# EAGLE schematic PCB-TLY-JACK-MEGA (EAGLE 6.5.0)

## Sheet 1 of 2
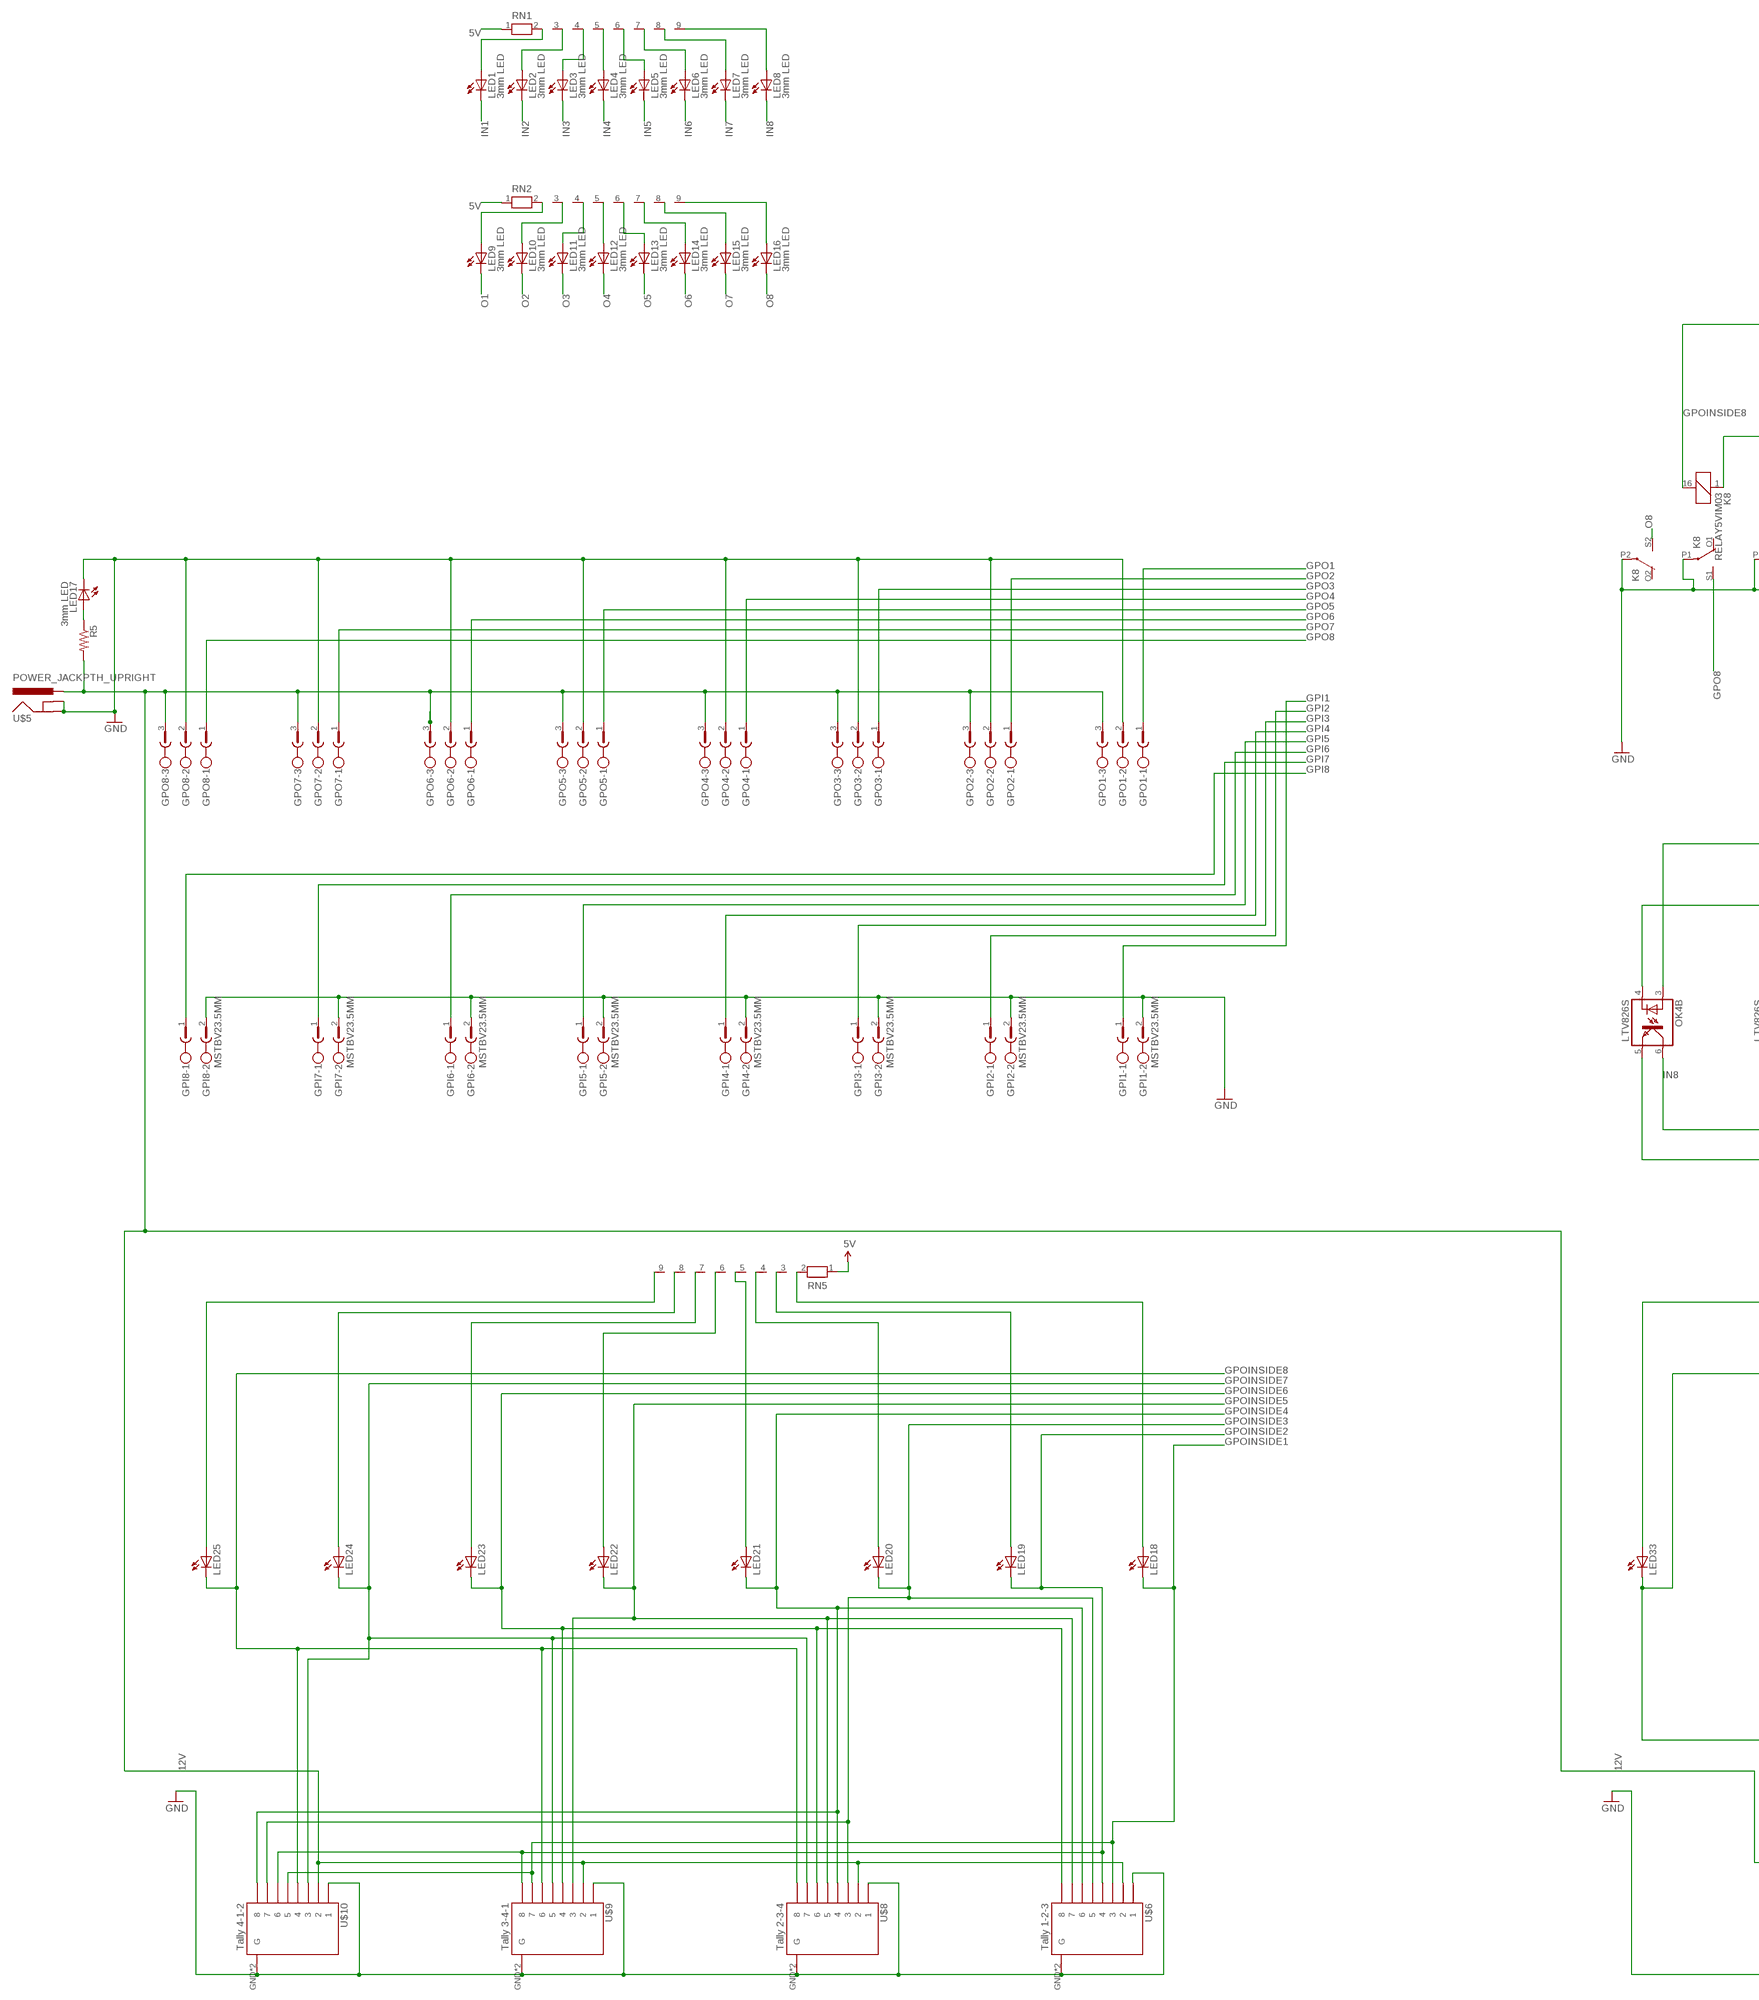
[diagram p0: schematic, sheet 1, part 1 of 2]
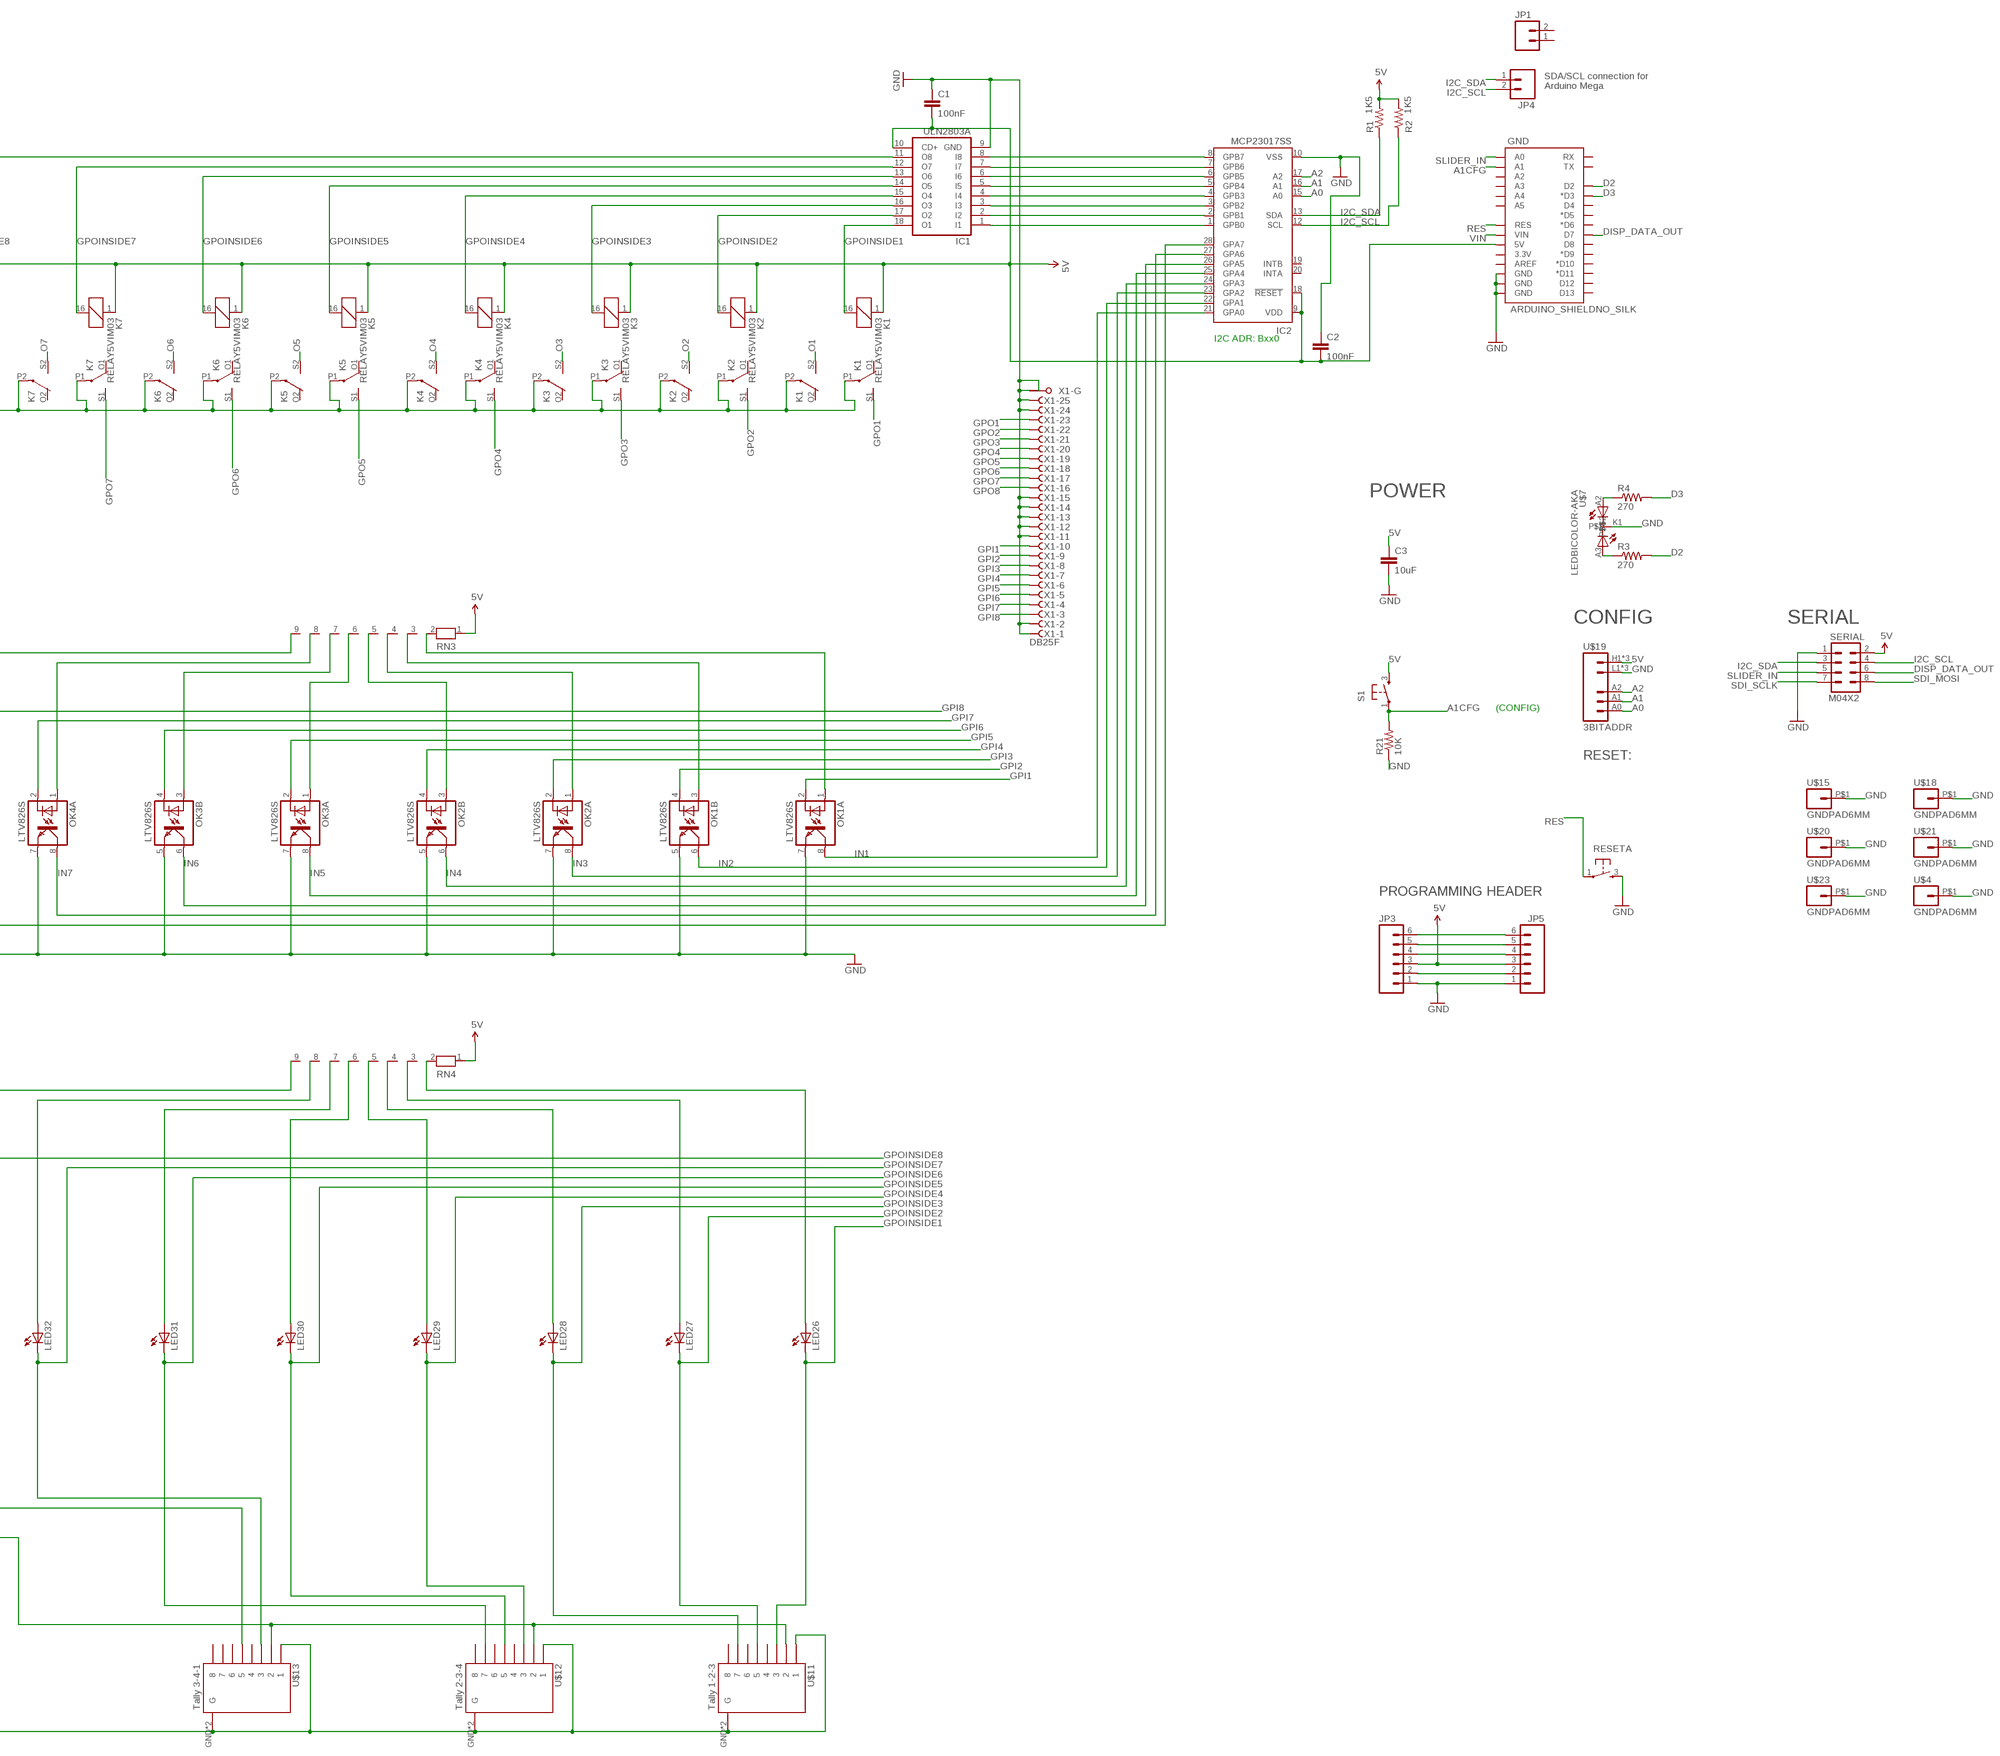
[diagram p1: schematic, sheet 1, part 2 of 2]

### Parts
C1  100nF  CAP0805  [0805]
C2  100nF  CAP0603-CAP  [0603-CAP]
C3  10uF  CAP0805  [0805]
GND  ARDUINO_SHIELDNO_SILK  [DUEMILANOVE_VIAS]
GPI1  MSTBV23.5MM  [MSTBV2-3.5]
GPI2  MSTBV23.5MM  [MSTBV2-3.5]
GPI3  MSTBV23.5MM  [MSTBV2-3.5]
GPI4  MSTBV23.5MM  [MSTBV2-3.5]
GPI5  MSTBV23.5MM  [MSTBV2-3.5]
GPI6  MSTBV23.5MM  [MSTBV2-3.5]
GPI7  MSTBV23.5MM  [MSTBV2-3.5]
GPI8  MSTBV23.5MM  [MSTBV2-3.5]
GPO1  CON1  MSTBV33.5MM  [MSTBV3-3.5]
GPO2  CON1  MSTBV33.5MM  [MSTBV3-3.5]
GPO3  CON1  MSTBV33.5MM  [MSTBV3-3.5]
GPO4  CON1  MSTBV33.5MM  [MSTBV3-3.5]
GPO5  CON1  MSTBV33.5MM  [MSTBV3-3.5]
GPO6  CON1  MSTBV33.5MM  [MSTBV3-3.5]
GPO7  CON1  MSTBV33.5MM  [MSTBV3-3.5]
GPO8  CON1  MSTBV33.5MM  [MSTBV3-3.5]
IC1  ULN2803A  ULN2803ASO18W  [SO18W]
IC2  MCP23017SS  [SSOP28]
JP1  M02PTH  [1X02]
JP3  M06POLAR  [MOLEX-1X6]
JP4  M02PTH  [1X02]
JP5  M06POLAR  [MOLEX-1X6]
K1  RELAY5VIM03  [DS2Y]
K2  RELAY5VIM03  [DS2Y]
K3  RELAY5VIM03  [DS2Y]
K4  RELAY5VIM03  [DS2Y]
K5  RELAY5VIM03  [DS2Y]
K6  RELAY5VIM03  [DS2Y]
K7  RELAY5VIM03  [DS2Y]
K8  RELAY5VIM03  [DS2Y]
LED1  3mm LED  LED3MM  [LED3MM]
LED2  3mm LED  LED3MM  [LED3MM]
LED3  3mm LED  LED3MM  [LED3MM]
LED4  3mm LED  LED3MM  [LED3MM]
LED5  3mm LED  LED3MM  [LED3MM]
LED6  3mm LED  LED3MM  [LED3MM]
LED7  3mm LED  LED3MM  [LED3MM]
LED8  3mm LED  LED3MM  [LED3MM]
LED9  3mm LED  LED3MM  [LED3MM]
LED10  3mm LED  LED3MM  [LED3MM]
LED11  3mm LED  LED3MM  [LED3MM]
LED12  3mm LED  LED3MM  [LED3MM]
LED13  3mm LED  LED3MM  [LED3MM]
LED14  3mm LED  LED3MM  [LED3MM]
LED15  3mm LED  LED3MM  [LED3MM]
LED16  3mm LED  LED3MM  [LED3MM]
LED17  3mm LED  LED3MM  [LED3MM]
LED18  LED3MM  [LED3MM]
LED19  LED3MM  [LED3MM]
LED20  LED3MM  [LED3MM]
LED21  LED3MM  [LED3MM]
LED22  LED3MM  [LED3MM]
LED23  LED3MM  [LED3MM]
LED24  LED3MM  [LED3MM]
LED25  LED3MM  [LED3MM]
LED26  LED3MM  [LED3MM]
LED27  LED3MM  [LED3MM]
LED28  LED3MM  [LED3MM]
LED29  LED3MM  [LED3MM]
LED30  LED3MM  [LED3MM]
LED31  LED3MM  [LED3MM]
LED32  LED3MM  [LED3MM]
LED33  LED3MM  [LED3MM]
OK1  LTV826S  [DIL8-SMD]
OK2  LTV826S  [DIL8-SMD]
OK3  LTV826S  [DIL8-SMD]
OK4  LTV826S  [DIL8-SMD]
R1  1K5  RESISTOR0603-RES  [0603-RES]
R2  1K5  RESISTOR0603-RES  [0603-RES]
R3  270  RESISTOR0603-RES  [0603-RES]
R4  270  RESISTOR0603-RES  [0603-RES]
R5  RESISTOR0603-RES  [0603-RES]
R21  10K  RESISTOR0603-RES  [0603-RES]
RESETA  TAC_SWITCH  [PUSHBUTTON]
RN1  RN08  [RN-9]
RN2  RN08  [RN-9]
RN3  RN08  [RN-9]
RN4  RN08  [RN-9]
RN5  RN08  [RN-9]
S1  TAC_SWITCH  [PUSHBUTTON]
SERIAL  M04X2  [2X4]
U$4  GNDPAD6MM  [3.2MMPAD6MM]
U$5  POWER_JACKPTH_UPRIGHT  [POWER_JACK_PTH_UPRIGHT]
U$6  Tally 1-2-3  RJ45-8_GNDUPRIGHT  [RJ45-8_GND_UPRIGHT]
U$7  LEDBICOLOR-AKA  [LED5MM-BICOLOR]
U$8  Tally 2-3-4  RJ45-8_GNDUPRIGHT  [RJ45-8_GND_UPRIGHT]
U$9  Tally 3-4-1  RJ45-8_GNDUPRIGHT  [RJ45-8_GND_UPRIGHT]
U$10  Tally 4-1-2  RJ45-8_GNDUPRIGHT  [RJ45-8_GND_UPRIGHT]
U$11  Tally 1-2-3  RJ45-8_GNDUPRIGHT  [RJ45-8_GND_UPRIGHT]
U$12  Tally 2-3-4  RJ45-8_GNDUPRIGHT  [RJ45-8_GND_UPRIGHT]
U$13  Tally 3-4-1  RJ45-8_GNDUPRIGHT  [RJ45-8_GND_UPRIGHT]
U$15  GNDPAD6MM  [3.2MMPAD6MM]
U$18  GNDPAD6MM  [3.2MMPAD6MM]
U$19  3BITADDR  [3BITADDR]
U$20  GNDPAD6MM  [3.2MMPAD6MM]
U$21  GNDPAD6MM  [3.2MMPAD6MM]
U$23  GNDPAD6MM  [3.2MMPAD6MM]
X1  DB25F  F25HPS  [F25HP]

### Nets
5V [PWR]: C1.2 C2.2 C3.1 GND.5V IC1.10(CD+) IC2.9(VDD) IC2.18(!RESET) JP3.3 JP5.3 K1.1 K2.1 K3.1 K4.1 K5.1 K6.1 K7.1 K8.1 R1.2 R2.2 RN1.1 RN2.1 RN3.1 RN4.1 RN5.1 S1.3 SERIAL.2 U$19.H1(VCC) U$19.H2(VCC) U$19.H3(VCC)
12V [PWR]: GPO1.3 GPO2.3 GPO3.3 GPO4.3 GPO5.3 GPO6.3 GPO7.3 GPO8.3 R5.2 U$5.PWR U$6.2 U$8.2 U$9.2 U$10.2 U$11.2 U$12.2 U$13.2
A0: IC2.15(A0) U$19.A0
A1: IC2.16(A1) U$19.A1
A1CFG: GND.A1 R21.2 S1.1
A2: IC2.17(A2) U$19.A2
D2: GND.D2 R3.2
D3: GND.D3(*D3) R4.2
DISP_DATA_OUT: GND.D7 SERIAL.6
GND [PWR]: C1.1 C2.1 C3.2 GND.GND@0(GND) GND.GND@1(GND) GND.GND@2(GND) GPI1.2 GPI2.2 GPI3.2 GPI4.2 GPI5.2 GPI6.2 GPI7.2 GPI8.2 GPO1.2 GPO2.2 GPO3.2 GPO4.2 GPO5.2 GPO6.2 GPO7.2 GPO8.2 IC1.9(GND) IC2.10(VSS) JP3.1 JP5.1 K1.P1(2:P) K1.P2(3:P) K2.P1(2:P) K2.P2(3:P) K3.P1(2:P) K3.P2(3:P) K4.P1(2:P) K4.P2(3:P) K5.P1(2:P) K5.P2(3:P) K6.P1(2:P) K6.P2(3:P) K7.P1(2:P) K7.P2(3:P) K8.P1(2:P) K8.P2(3:P) LED17.K(C) OK1.5(B:EMIT) OK1.7(A:EMIT) OK2.5(B:EMIT) OK2.7(A:EMIT) OK3.5(B:EMIT) OK3.7(A:EMIT) OK4.5(B:EMIT) OK4.7(A:EMIT) R21.1 RESETA.3 SERIAL.1 U$4.P$1 U$5.GND U$5.SHUNT(GNDBREAK) U$6.1 U$6.GND1(G) U$6.GND(G) U$7.K1 U$8.1 U$8.GND1(G) U$8.GND(G) U$9.1 U$9.GND1(G) U$9.GND(G) U$10.1 U$10.GND1(G) U$10.GND(G) U$11.1 U$11.GND1(G) U$11.GND(G) U$12.1 U$12.GND1(G) U$12.GND(G) U$13.1 U$13.GND1(G) U$13.GND(G) U$15.P$1 U$18.P$1 U$19.L1(GND) U$19.L2(GND) U$19.L3(GND) U$20.P$1 U$21.P$1 U$23.P$1 X1.1(-1:F) X1.2(-2:F) X1.11(-11:F) X1.12(-12:F) X1.13(-13:F) X1.14(-14:F) X1.15(-15:F) X1.24(-24:F) X1.25(-25:F) X1.G1(-G:G1) X1.G2(-G:G2)
GPI1 [INput lines]: GPI1.1 OK1.2(A:C) X1.10(-10:F)
GPI2 [INput lines]: GPI2.1 OK1.4(B:C) X1.9(-9:F)
GPI3 [INput lines]: GPI3.1 OK2.2(A:C) X1.8(-8:F)
GPI4 [INput lines]: GPI4.1 OK2.4(B:C) X1.7(-7:F)
GPI5 [INput lines]: GPI5.1 OK3.2(A:C) X1.6(-6:F)
GPI6 [INput lines]: GPI6.1 OK3.4(B:C) X1.5(-5:F)
GPI7 [INput lines]: GPI7.1 OK4.2(A:C) X1.4(-4:F)
GPI8 [INput lines]: GPI8.1 OK4.4(B:C) X1.3(-3:F)
GPO1 [RELAY LINES]: GPO1.1 K1.S1(2:S) X1.23(-23:F)
GPO2 [RELAY LINES]: GPO2.1 K2.S1(2:S) X1.22(-22:F)
GPO3 [RELAY LINES]: GPO3.1 K3.S1(2:S) X1.21(-21:F)
GPO4 [RELAY LINES]: GPO4.1 K4.S1(2:S) X1.20(-20:F)
GPO5 [RELAY LINES]: GPO5.1 K5.S1(2:S) X1.19(-19:F)
GPO6 [RELAY LINES]: GPO6.1 K6.S1(2:S) X1.18(-18:F)
GPO7 [RELAY LINES]: GPO7.1 K7.S1(2:S) X1.17(-17:F)
GPO8 [RELAY LINES]: GPO8.1 K8.S1(2:S) X1.16(-16:F)
GPOINSIDE1: IC1.18(O1) K1.16 LED18.K(C) LED26.K(C) U$6.3 U$9.7 U$10.5 U$11.3
GPOINSIDE2: IC1.17(O2) K2.16 LED19.K(C) LED27.K(C) U$6.4 U$9.8 U$10.6 U$11.5
GPOINSIDE3: IC1.16(O3) K3.16 LED20.K(C) LED28.K(C) U$6.5 U$8.3 U$10.7 U$11.7
GPOINSIDE4: IC1.15(O4) K4.16 LED21.K(C) LED29.K(C) U$6.6 U$8.4 U$10.8 U$12.3
GPOINSIDE5: IC1.14(O5) K5.16 LED22.K(C) LED30.K(C) U$6.7 U$8.5 U$9.3 U$12.5
GPOINSIDE6: IC1.13(O6) K6.16 LED23.K(C) LED31.K(C) U$6.8 U$8.6 U$9.4 U$12.7
GPOINSIDE7: IC1.12(O7) K7.16 LED24.K(C) LED32.K(C) U$8.7 U$9.5 U$10.3 U$13.3
GPOINSIDE8: IC1.11(O8) K8.16 LED25.K(C) LED33.K(C) U$8.8 U$9.6 U$10.4 U$13.5
I2C_SCL: IC2.12(SCL) JP4.2 R2.1 SERIAL.4
I2C_SDA: IC2.13(SDA) JP4.1 R1.1 SERIAL.3
IN1: IC2.21(GPA0) LED1.K(C) OK1.8(A:COL)
IN2: IC2.22(GPA1) LED2.K(C) OK1.6(B:COL)
IN3: IC2.23(GPA2) LED3.K(C) OK2.8(A:COL)
IN4: IC2.24(GPA3) LED4.K(C) OK2.6(B:COL)
IN5: IC2.25(GPA4) LED5.K(C) OK3.8(A:COL)
IN6: IC2.26(GPA5) LED6.K(C) OK3.6(B:COL)
IN7: IC2.27(GPA6) LED7.K(C) OK4.8(A:COL)
IN8: IC2.28(GPA7) LED8.K(C) OK4.6(B:COL)
N$1: LED1.A RN1.2
N$2: LED2.A RN1.3
N$3: JP3.4 JP5.4
N$4: LED18.A RN5.2
N$5: IC1.1(I1) IC2.1(GPB0)
N$6: LED3.A RN1.4
N$7: R4.1 U$7.A2
N$8: JP3.5 JP5.5
N$9: LED19.A RN5.3
N$10: LED4.A RN1.5
N$11: R3.1 U$7.A3
N$12: JP3.2 JP5.2
N$13: LED20.A RN5.4
N$14: LED5.A RN1.6
N$15: LED6.A RN1.7
N$16: LED7.A RN1.8
N$17: LED21.A RN5.5
N$18: LED8.A RN1.9
N$19: LED9.A RN2.2
N$20: LED10.A RN2.3
N$21: LED22.A RN5.6
N$22: LED11.A RN2.4
N$23: LED12.A RN2.5
N$24: LED13.A RN2.6
N$25: LED23.A RN5.7
N$26: LED14.A RN2.7
N$27: LED15.A RN2.8
N$28: LED16.A RN2.9
N$29: LED24.A RN5.8
N$30: LED17.A R5.1
N$31: LED25.A RN5.9
N$32: LED26.A RN4.2
N$33: LED27.A RN4.3
N$34: IC1.2(I2) IC2.2(GPB1)
N$35: IC1.3(I3) IC2.3(GPB2)
N$36: IC1.4(I4) IC2.4(GPB3)
N$37: IC1.5(I5) IC2.5(GPB4)
N$38: IC1.6(I6) IC2.6(GPB5)
N$39: IC1.7(I7) IC2.7(GPB6)
N$40: IC1.8(I8) IC2.8(GPB7)
N$41: LED28.A RN4.4
N$42: LED29.A RN4.5
N$43: LED30.A RN4.6
N$44: LED31.A RN4.7
N$45: JP3.6 JP5.6
N$46: LED32.A RN4.8
N$47: LED33.A RN4.9
N$48: OK1.1(A:A) RN3.2
N$49: OK1.3(B:A) RN3.3
N$50: OK2.1(A:A) RN3.4
N$51: OK2.3(B:A) RN3.5
N$52: OK3.1(A:A) RN3.6
N$53: OK3.3(B:A) RN3.7
N$54: OK4.1(A:A) RN3.8
N$55: OK4.3(B:A) RN3.9
O1: K1.S2(3:S) LED9.K(C)
O2: K2.S2(3:S) LED10.K(C)
O3: K3.S2(3:S) LED11.K(C)
O4: K4.S2(3:S) LED12.K(C)
O5: K5.S2(3:S) LED13.K(C)
O6: K6.S2(3:S) LED14.K(C)
O7: K7.S2(3:S) LED15.K(C)
O8: K8.S2(3:S) LED16.K(C)
RES: GND.RES RESETA.1
SDI_MOSI: SERIAL.8
SDI_SCLK: SERIAL.7
SLIDER_IN: GND.A0 SERIAL.5
VIN: GND.VIN
Unconnected: GND.3.3V GND.A2 GND.A3 GND.A4 GND.A5 GND.AREF GND.D4 GND.D5(*D5) GND.D6(*D6) GND.D8 GND.D9(*D9) GND.D10(*D10) GND.D11(*D11) GND.D12 GND.D13 GND.RX GND.TX IC2.19(INTB) IC2.20(INTA) JP1.1 JP1.2 K1.O1(2:O) K1.O2(3:O) K2.O1(2:O) K2.O2(3:O) K3.O1(2:O) K3.O2(3:O) K4.O1(2:O) K4.O2(3:O) K5.O1(2:O) K5.O2(3:O) K6.O1(2:O) K6.O2(3:O) K7.O1(2:O) K7.O2(3:O) K8.O1(2:O) K8.O2(3:O) U$11.4 U$11.6 U$11.8 U$12.4 U$12.6 U$12.8 U$13.4 U$13.6 U$13.7 U$13.8

### Notes on the sheet
- SDA/SCL connection for
- Arduino Mega
- I2C ADR: Bxx0
- POWER
- CONFIG | SERIAL
- (CONFIG)
- RESET:
- PROGRAMMING HEADER

## Sheet 2 of 2

## Library data of the parts
C1-C3 = SparkFun:CAP: Capacitor Standard 0603 ceramic capacitor, and 0.1" leaded capacitor.
GND = SparkFun:ARDUINO_SHIELD
GPI1-GPI8 = SKAARHOJ:MSTBV2: PHOENIX
GPO1-GPO8 = SKAARHOJ:MSTBV3: PHOENIX
IC1 = uln-udn:ULN2803A: DRIVER ARRAY
IC2 = microchip:MCP23017: http://ww1.microchip.com/downloads/en/DeviceDoc/21952a.pdf Source: http://ww1.microchip.com/downloads/en/DeviceDoc/21952a.pdf; MF: MICROCHIP; MPN: MCP23017-E/SS; OC_FARNELL: 1467674; OC_NEWARK: 31K2960
JP1 JP4 = SparkFun:M02: Header 2 Standard 2-pin 0.1" header. Use with straight break away headers (SKU : PRT-00116), right angle break away headers (PRT-00553), swiss pins (PRT-00743), machine pins (PRT-00117), and female headers (PRT-00115). Molex polarized connector foot print use with SKU : PRT-08233 with associated crimp pins and housings.
JP3 JP5 = SparkFun:M06: Header 6 Standard 6-pin 0.1" header. Use with straight break away headers (SKU : PRT-00116), right angle break away headers (PRT-00553), swiss pins (PRT-00743), machine pins (PRT-00117), and female headers (PRT-00115). Molex polarized connector foot print use with SKU : PRT-08094 with associated crimp pins and housings. NOTES ON THE VARIANTS LOCK and LOCK_LONGPADS... This footprint was designed to help hold the alignment of a through-hole component (i.e. 6-pin header) while soldering it into place. You may notice that each hole has been shifted either up or down by 0.005 of an inch from it's more standard position (which is a perfectly straight line). This slight alteration caused the pins (the squares in the middle) to touch the edges of the holes. Because they are alternating, it causes a "brace" to hold the component in place. 0.005 has proven to be the perfect amount of "off-center" position when using our standard breakaway headers. Although looks a little odd when you look at the bare footprint, once you have a header in there, the alteration is very hard to notice. Also, if you push a header all the way into place, it is covered up entirely on the bottom side. This idea of altering the position of holes to aid alignment will be further integrated into the Sparkfun Library for other footprints. It can help hold any component with 3 or more connection pins.
K1-K8 = SKAARHOJ:RELAY5V: RELAY 2 x switch, AxiCom 150 mW 5V
LED1-LED17 = SKAARHOJ:LED: KINGBRIGHT 20MM BIG LAMP
LED18-LED33 = led:LED: LED OSRAM: - CHIPLED LG R971, LG N971, LY N971, LG Q971, LY Q971, LO R971, LY R971 LH N974, LH R974 LS Q976, LO Q976, LY Q976 LO Q996 - Hyper CHIPLED LW Q18S LB Q993, LB Q99A, LB R99A - SideLED LS A670, LO A670, LY A670, LG A670, LP A670 LB A673, LV A673, LT A673, LW A673 LH A674 LY A675 LS A676, LA A676, LO A676, LY A676, LW A676 LS A679, LY A679, LG A679 - Hyper Micro SIDELED® LS Y876, LA Y876, LO Y876, LY Y876 LT Y87S - SmartLED LW L88C, LW L88S LB L89C, LB L89S, LG L890 LS L89K, LO L89K, LY L89K LS L896, LA L896, LO L896, LY L896 - TOPLED LS T670, LO T670, LY T670, LG T670, LP T670 LSG T670, LSP T670, LSY T670, LOP T670, LYG T670 LG T671, LOG T671, LSG T671 LB T673, LV T673, LT T673, LW T673 LH T674 LS T676, LA T676, LO T676, LY T676, LB T676, LH T676, LSB T676, LW T676 LB T67C, LV T67C, LT T67C, LS T67K, LO T67K, LY T67K, LW E67C LS E67B, LA E67B, LO E67B, LY E67B, LB E67C, LV E67C, LT E67C LW T67C LS T679, LY T679, LG T679 LS T770, LO T770, LY T770, LG T770, LP T770 LB T773, LV T773, LT T773, LW T773 LH T774 LS E675, LA E675, LY E675, LS T675 LS T776, LA T776, LO T776, LY T776, LB T776 LHGB T686 LT T68C, LB T68C - Hyper Mini TOPLED® LB M676 - Mini TOPLED Santana® LG M470 LS M47K, LO M47K, LY M47K Source: http://www.osram.convergy.de LUXEON: - LUMILED® LXK2-PW12-R00, LXK2-PW12-S00, LXK2-PW14-U00, LXK2-PW14-V00 LXK2-PM12-R00, LXK2-PM12-S00, LXK2-PM14-U00 LXK2-PE12-Q00, LXK2-PE12-R00, LXK2-PE12-S00, LXK2-PE14-T00, LXK2-PE14-U00 LXK2-PB12-K00, LXK2-PB12-L00, LXK2-PB12-M00, LXK2-PB14-N00, LXK2-PB14-P00, LXK2-PB14-Q00 LXK2-PR12-L00, LXK2-PR12-M00, LXK2-PR14-Q00, LXK2-PR14-R00 LXK2-PD12-Q00, LXK2-PD12-R00, LXK2-PD12-S00 LXK2-PH12-R00, LXK2-PH12-S00 LXK2-PL12-P00, LXK2-PL12-Q00, LXK2-PL12-R00 Source: www.luxeon.com KINGBRIGHT: KA-3528ASYC Source: www.kingbright.com
OK1-OK4 = optocoupler:LTV826: OPTO COUPLER Source: LITEON, LTV816.pdf; OC_FARNELL: unknown; OC_NEWARK: unknown
R1-R5 R21 = SparkFun:RESISTOR: Resistor Basic schematic elements and footprints for 0603, 1206, and PTH resistors.
RESETA S1 = SKAARHOJ:TAC_SWITCH: Momentary Switch Button commonly used for reset or general input. Spark Fun Electronics SKU : COM-00097
RN1-RN5 = SKAARHOJ:RN08: RESISTOR NETWORK; OC_FARNELL: unknown; OC_NEWARK: unknown
SERIAL = SparkFun:M04X2
U$4 U$15 U$18 U$20 U$21 U$23 = SKAARHOJ:GNDPAD
U$5 = SKAARHOJ:POWER_JACK: RASM712PX Right Angle SMT Mount DC Power Jack, pin size 0.100"(2.5mm), with locating post Switchcraft.com
U$6 U$8-U$13 = SKAARHOJ:RJ45-8_GND
U$7 = SKAARHOJ:LEDBICOLOR-AKA
U$19 = SKAARHOJ:3BITADDR
X1 = con-subd:F25HPS: SUB-D; OC_FARNELL: unknown; OC_NEWARK: unknown

## Net classes
0 default: width 0.203 mm, drill 0.406 mm, clearance 0.203 mm
1 PWR: width 0.406 mm, drill 0.61 mm, clearance 0.203 mm
2 RELAY LINES: width 0.305 mm, clearance 0.203 mm
3 INput lines: clearance 0.203 mm